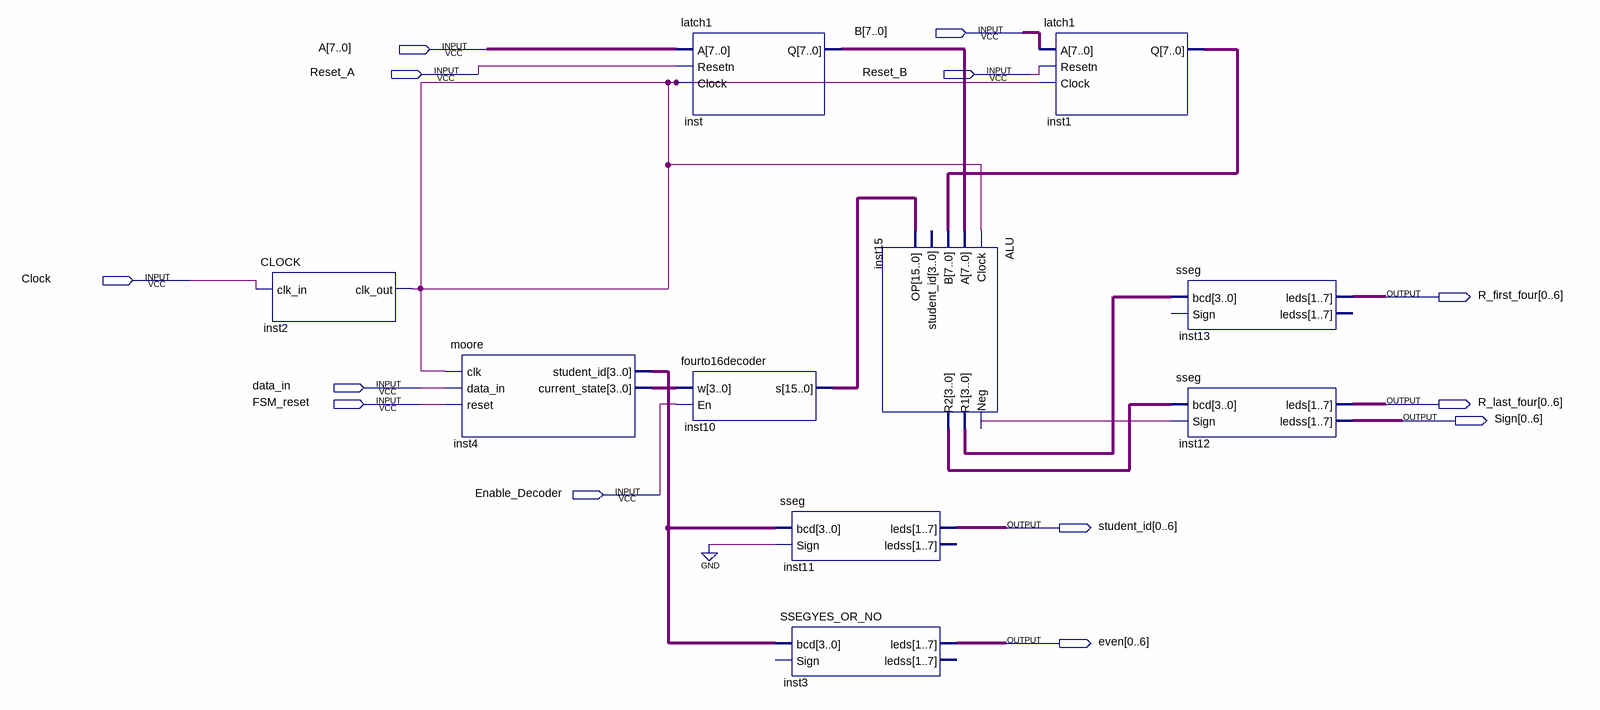
[diagram p0: schematic sheet]
// Quartus schematic Problem1BLOCK.bdf as structural Verilog: 10 symbols, 13 pins
module Problem1BLOCK (
  input  [7:0] B,
  input  [7:0] A,
  input  Reset_A,
  input  Reset_B,
  input  Clock,
  input  data_in,
  input  FSM_reset,
  input  Enable_Decoder,
  output [0:6] R_first_four,
  output [0:6] R_last_four,
  output [0:6] Sign,
  output [0:6] student_id,
  output [0:6] even
);

  wire inst2_clk_out, inst15_neg;
  wire [3:0] inst4_current_state, inst4_student_id, inst15_r1, inst15_r2;
  wire [7:0] inst1_q, inst_q;
  wire [15:0] inst10_s;

  CLOCK inst2 (.clk_in(Clock), .clk_out(inst2_clk_out));
  moore inst4 (
    .clk(inst2_clk_out), .data_in(data_in), .reset(FSM_reset), .student_id(inst4_student_id),
    .current_state(inst4_current_state));
  latch1 inst (.A(A), .Resetn(Reset_A), .Clock(inst2_clk_out), .Q(inst_q));
  fourto16decoder inst10 (.w(inst4_current_state), .En(Enable_Decoder), .s(inst10_s));
  sseg inst11 (.bcd(inst4_student_id), .Sign(1'b0), .leds(student_id));  // open: ledss
  SSEGYES_OR_NO inst3 (.bcd(inst4_student_id), .leds(even));  // open: Sign, ledss
  ALU inst15 (
    .Clock(inst2_clk_out), .A(inst_q), .B(inst1_q), .OP(inst10_s), .Neg(inst15_neg), .R1(inst15_r1),
    .R2(inst15_r2));  // open: student_id
  latch1 inst1 (.A(B), .Resetn(Reset_B), .Clock(inst2_clk_out), .Q(inst1_q));
  sseg inst13 (.bcd(inst15_r1), .leds(R_first_four));  // open: Sign, ledss
  sseg inst12 (.bcd(inst15_r2), .Sign(inst15_neg), .leds(R_last_four), .ledss(Sign));
endmodule
